# EAGLE schematic LED Breakout Board (EAGLE 7.1.0)
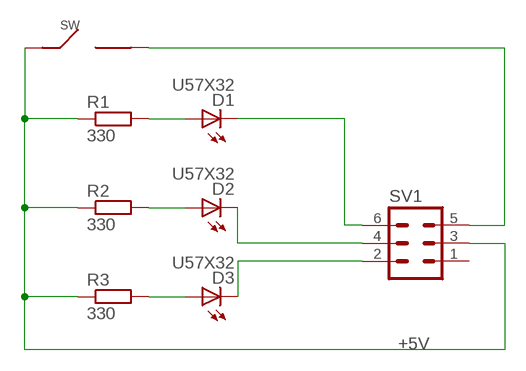
[diagram p0: schematic, sheet 1]

## Parts
D1  U57X32  [U57X32]
D2  U57X32  [U57X32]
D3  U57X32  [U57X32]
R1  330  R-EU_R3225  [R3225]
R2  330  R-EU_R3225  [R3225]
R3  330  R-EU_R3225  [R3225]
SV1  MA03-2  [MA03-2]
SW  PUSHBUTTON  [PUSHBUTTON]

## Nets
+5V: R1.1 R2.1 R3.1 SV1.3 SW.IN
N$1: D3.A R3.2
N$2: D2.A R2.2
N$3: D1.A R1.2
N$4: D1.K(C) SV1.6
N$5: D2.K(C) SV1.4
N$6: D3.K(C) SV1.2
SW: SV1.5 SW.OUT
Unconnected: SV1.1

## Library data of the parts
D1-D3 = led:U57X32: LED rectangle, 5.7 x 3.2 mm
R1-R3 = rcl:R-EU_: RESISTOR, European symbol
SV1 = con-lstb:MA03-2: PIN HEADER; OC_FARNELL: unknown; OC_NEWARK: unknown
SW = pushbutton:PUSHBUTTON